# EAGLE design rs232 (EAGLE 9.2.2)
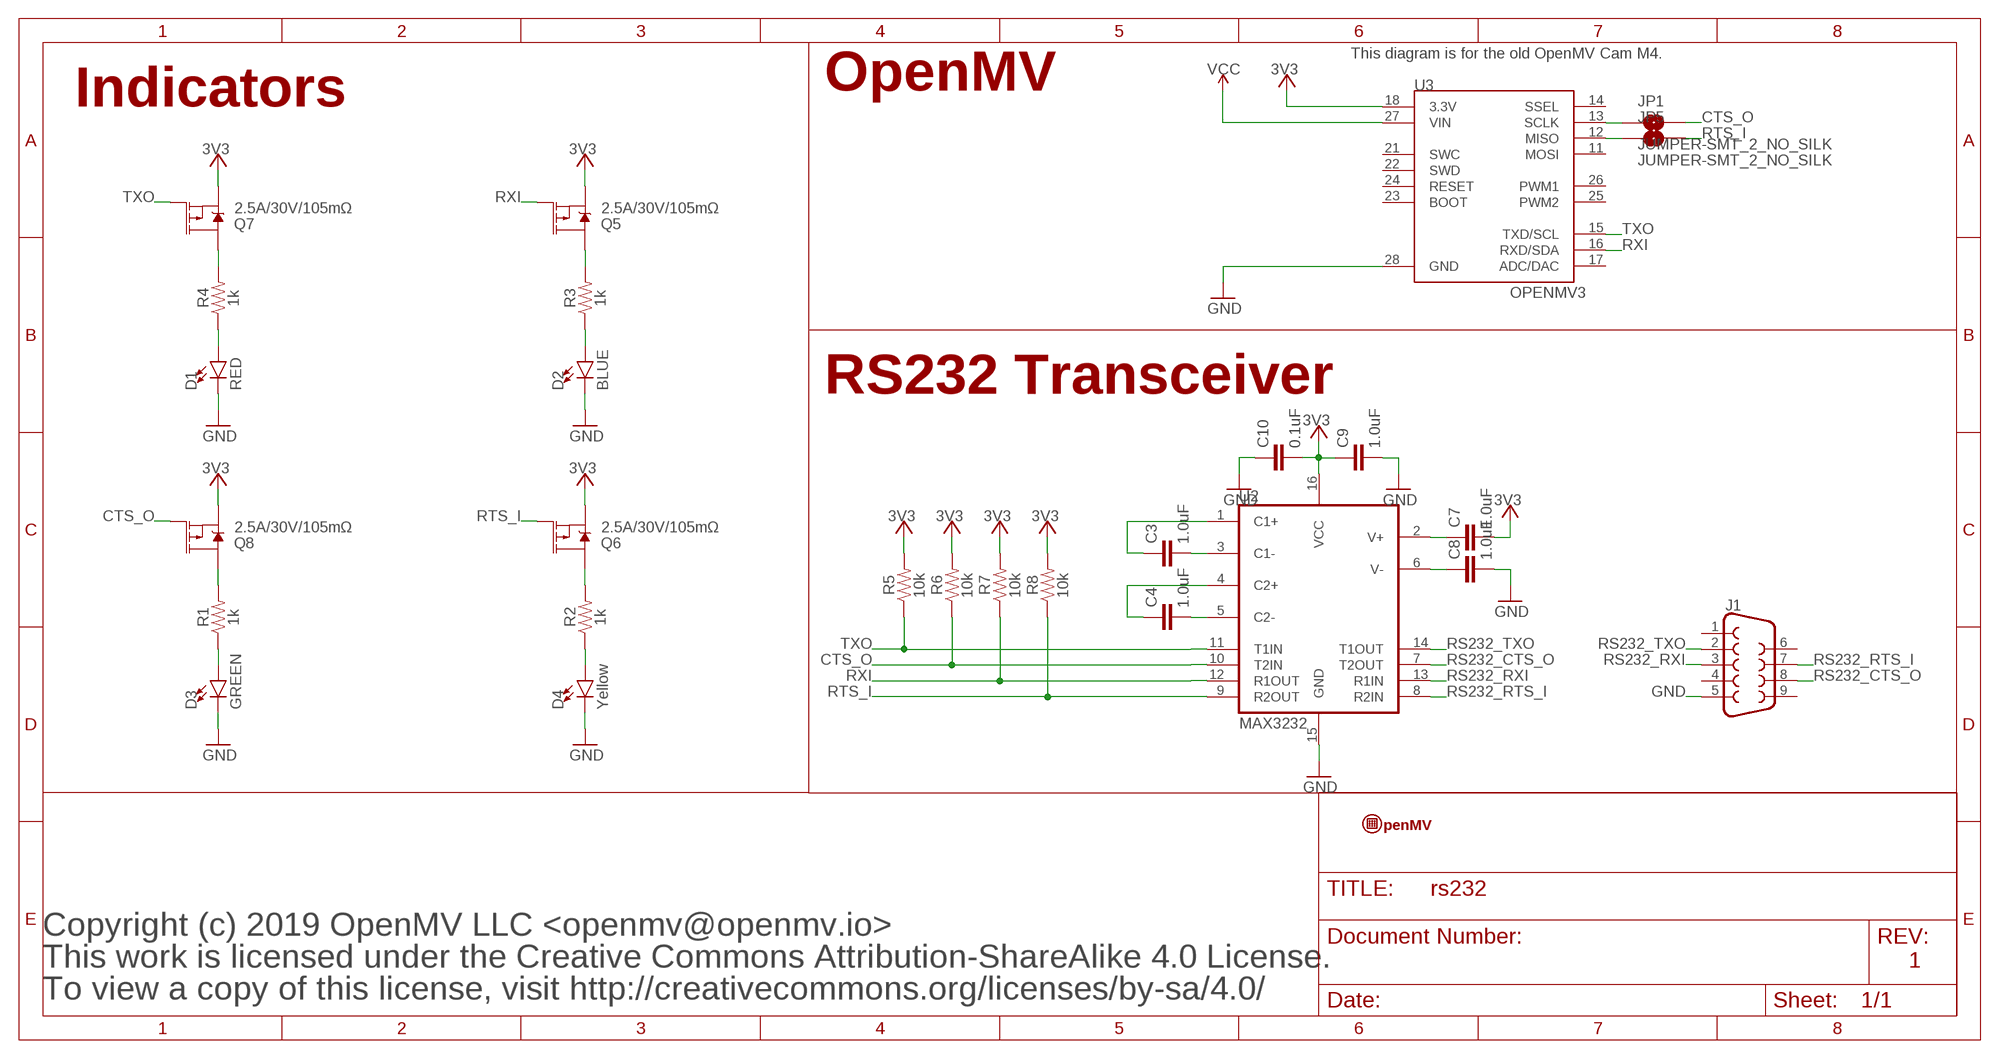
[diagram p0: schematic, sheet 1]

## Parts
C3  1.0uF  1.0UF-0603-16V-10%  [0603]
C4  1.0uF  1.0UF-0603-16V-10%  [0603]
C7  1.0uF  1.0UF-0603-16V-10%  [0603]
C8  1.0uF  1.0UF-0603-16V-10%  [0603]
C9  1.0uF  1.0UF-0603-16V-10%  [0603]
C10  0.1uF  0.1UF-0603-25V-(+80/-20%)  [0603]
D1  RED  LED-RED0603  [LED-0603]
D2  BLUE  LED-BLUE0603  [LED-0603]
D3  GREEN  LED-GREEN0603  [LED-0603]
D4  Yellow  LED-YELLOW0603  [LED-0603]
J1  DB9FEMALE  [DB9]
JP1  JUMPER-SMT_2_NO_SILK  [SMT-JUMPER_2_NO_SILK]
JP5  JUMPER-SMT_2_NO_SILK  [SMT-JUMPER_2_NO_SILK]
Q5  2.5A/30V/105mΩ  MOSFET_PCH-DMG2307L  [SOT23-3]
Q6  2.5A/30V/105mΩ  MOSFET_PCH-DMG2307L  [SOT23-3]
Q7  2.5A/30V/105mΩ  MOSFET_PCH-DMG2307L  [SOT23-3]
Q8  2.5A/30V/105mΩ  MOSFET_PCH-DMG2307L  [SOT23-3]
R1  1k  1KOHM-0603-1/10W-1%  [0603]
R2  1k  1KOHM-0603-1/10W-1%  [0603]
R3  1k  1KOHM-0603-1/10W-1%  [0603]
R4  1k  1KOHM-0603-1/10W-1%  [0603]
R5  10k  10KOHM-0603-1/10W-1%  [0603]
R6  10k  10KOHM-0603-1/10W-1%  [0603]
R7  10k  10KOHM-0603-1/10W-1%  [0603]
R8  10k  10KOHM-0603-1/10W-1%  [0603]
U2  MAX3232  MAX2323SOIC16  [SO16]
U3  OPENMV3  [OPENMV3]
U$9  OPENMV-LOGO  [OPENMV-LOGO]

## Nets
3V3: C7.2 C9.1 C10.2 Q5.2(S) Q6.2(S) Q7.2(S) Q8.2(S) R5.2 R6.2 R7.2 R8.2 U2.16(VCC) U3.18(3.3V)
CTS_O: JP1.2 Q8.1(G) R6.1 U2.10(T2IN)
GND: C8.2 C9.2 C10.1 D1.C D2.C D3.C D4.C J1.5 U2.15(GND) U3.28(GND)
INT_CTS_O: JP1.1 U3.13(SCLK)
INT_RTS_I: JP5.1 U3.12(MISO)
N$1: C4.2 U2.5(C2-)
N$2: C4.1 U2.4(C2+)
N$3: C3.2 U2.3(C1-)
N$4: C3.1 U2.1(C1+)
N$5: C8.1 U2.6(V-)
N$6: Q7.3(D) R4.2
N$7: Q5.3(D) R3.2
N$8: Q6.3(D) R2.2
N$9: C7.1 U2.2(V+)
N$10: Q8.3(D) R1.2
N$11: D4.A R2.1
N$12: D3.A R1.1
N$13: D2.A R3.1
N$14: D1.A R4.1
RS232_CTS_O: J1.8 U2.7(T2OUT)
RS232_RTS_I: J1.7 U2.8(R2IN)
RS232_RXI: J1.3 U2.13(R1IN)
RS232_TXO: J1.2 U2.14(T1OUT)
RTS_I: JP5.2 Q6.1(G) R8.1 U2.9(R2OUT)
RXI: Q5.1(G) R7.1 U2.12(R1OUT) U3.16(RXD/SDA)
TXO: Q7.1(G) R5.1 U2.11(T1IN) U3.15(TXD/SCL)
VCC: U3.27(VIN)
Unconnected: J1.1 J1.4 J1.6 J1.9 U3.11(MOSI) U3.14(SSEL) U3.17(ADC/DAC) U3.21(SWC) U3.22(SWD) U3.23(BOOT) U3.24(RESET) U3.25(PWM2) U3.26(PWM1)

## Notes on the sheet
- This diagram is for the old OpenMV Cam M4.
- Indicators | OpenMV
- RS232 Transceiver
- Copyright (c) 2019 OpenMV LLC <openmv@openmv.io>
- This work is licensed under the Creative Commons Attribution-ShareAlike 4.0 License. | 1
- To view a copy of this license, visit http://creativecommons.org/licenses/by-sa/4.0/

## Library data of the parts
C3 C4 C7-C9 = SparkFun-Capacitors:1.0UF: 1µF ceramic capacitors A capacitor is a passive two-terminal electrical component used to store electrical energy temporarily in an electric field.; PROD_ID: CAP-00868
C10 = SparkFun-Capacitors:0.1UF: 0.1µF ceramic capacitors A capacitor is a passive two-terminal electrical component used to store electrical energy temporarily in an electric field.; PROD_ID: CAP-00810
D1 = SparkFun-LED:LED-RED: Red SMD LED Used in manufacturing of most products at SparkFun Packages: 0603 - SMD 0603 package [Product Link] <http://docs.avagotech.com/docs/AV02-0551EN> 0603 SMART - SMD 0603 SMART package ( more efficient and expensive)[Product Link] <http://www.osram-os.com/Graphics/XPic2/00077099_0.pdf> 1206 - SMD1206 package [Product Link] <https://www.sparkfun.com/datasheets/DevTools/LilyPad/Q150OVS4.pdff> SparkFun Products: Pro Mini 328 -5V <https://www.sparkfun.com/products/821> RedBoard <https://www.sparkfun.com/products/12757> IOIO-OTG <https://www.sparkfun.com/products/13613>; PROD_ID: DIO-00819
D2 = SparkFun-LED:LED-BLUE: Blue SMD LED Used in manufacturing of various products at SparkFun Packages: 0603 - SMD 0603 package [Product Link] <http://www.digikey.com/product-detail/en/SMLE12BC7TT86/511-1589-2-ND/1641808> 1206 - SMD1206 package [Product Link] <http://www.digikey.com/product-detail/en/lite-on-inc/LTST-C150TBKT/160-1643-1-ND/573584> SparkFun Products: ESP8266 Thing-Dev Board <https://www.sparkfun.com/products/13711> RedBoard <https://www.sparkfun.com/products/12757>; PROD_ID: DIO-08575
D3 = SparkFun-LED:LED-GREEN: Green SMD LED Used in manufacturing of various products at SparkFun Packages: 0603 - SMD 0603 package [Product Link] <http://www.futureelectronics.com/en/technologies/semiconductors/optoelectronics/leds/Pages/9894312-LTST-C190GKT.aspx?CrossPart=HSMG-C190&IM=0> LilyPad 1206 - SMD1206 LilyPad package [Product Link] <http://www.futureelectronics.com/en/Technologies/Product.aspx?ProductID=IN150NGHARVATEKCORPORATION2049943&IM=0> 1206 - SMD1206 package [Product Link] <http://www.futureelectronics.com/en/technologies/semiconductors/optoelectronics/leds/Pages/8315665-LTST-C150KGKT.aspx?IM=0> 1206 Bottom Mount -SMD 1206 Bottom Mount [Product Link] <http://www.digikey.com/product-detail/en/lite-on-inc/LTST-C230KGKT/160-1456-1-ND/386854> SparkFun Products: Pro Mini 328 -5V <https://www.sparkfun.com/products/821> RedBoard <https://www.sparkfun.com/products/12757> MP3 Trigger <https://www.sparkfun.com/products/13720> Makey Makey <https://www.sparkfun.com/products/11076>; PROD_ID: DIO-00821
D4 = SparkFun-LED:LED-YELLOW: Yellow SMD LED Used in manufacturing several products at SparkFun. Packages: 0603 - SMD 0603 package[Product Link] <http://www.kingbrightusa.com/product.asp?catalog_name=LED&product_id=APT1608SYCK> 0603 -SMART - SMART SMD 0603 package (more efficient/more expensive) [Product Link] <http://www.osram-os.com/osram_os/en/products/product-catalog/led-light-emitting-diodes/smartled-0603/ly-l29k/index.jsp> LilyPad - SMD1206 package[Product Datasheet] <https://www.sparkfun.com/datasheets/DevTools/LilyPad/Q150YUS4.pdf> SparkFun Products: Blynk Board <https://www.sparkfun.com/products/13794> IOIO-OTG <https://www.sparkfun.com/products/13613> XBee Explorer Serial <https://www.sparkfun.com/products/13225>; PROD_ID: DIO-09003
J1 = SparkFun-Connectors:DB9: DB9 Connector Standard DB9 (D-Sub 9) serial connector. Can be used for CAN bus as well as RS485 and RS232. Footprint production proven. Here is the female version connector we sell at SparkFun: 9 Pin Female Serial Connector - PCB Mount <https://www.sparkfun.com/products/429> (PRT-00429) This connector has been used on the following SparkFun products: SparkFun RS232 Shifter - SMD <https://www.sparkfun.com/products/449> (PRT-00449) SparkFun RS232 Shifter SMD (No DB9) <https://www.sparkfun.com/products/8780> (PRT-08780); PROD_ID: CONN-08194
JP1 JP5 = SparkFun-Jumpers:JUMPER-SMT_2_NO: Normally open jumper This jumper has two pads in close proximity to each other. Apply solder to close the connection. Round pads are easier to solder for beginners, but are a lot larger. SparkFun Product that uses the round pads: SparkFun EL Sequencer <https://www.sparkfun.com/products/12781>
Q5-Q8 = SparkFun-DiscreteSemi:MOSFET_PCH: P-channel MOSFETs Voltage controlled devices that allow control of high current outputs. SparkFun Products: SparkFun ESP32 Thing <https://www.sparkfun.com/products/13907> SparkFun ESP8266 Thing <https://www.sparkfun.com/products/13231>; PROD_ID: TRANS-11308
R1-R4 = SparkFun-Resistors:1KOHM: 1kΩ resistor A resistor is a passive two-terminal electrical component that implements electrical resistance as a circuit element. Resistors act to reduce current flow, and, at the same time, act to lower voltage levels within circuits. - Wikipedia; PROD_ID: RES-07856
R5-R8 = SparkFun-Resistors:10KOHM: 10kΩ resistor A resistor is a passive two-terminal electrical component that implements electrical resistance as a circuit element. Resistors act to reduce current flow, and, at the same time, act to lower voltage levels within circuits. - Wikipedia; PROD_ID: RES-00824
U2 = SparkFun-IC-Comms:MAX2323: RS232 Transceiver This part covers 232 drivers that are compatible with the MAX3232. Sipex SP3232EB Datasheet <http://cdn.sparkfun.com/datasheets/Components/General%20IC/SP3232EBCA-L.pdf> SparkFun Products SOIC component <https://www.sparkfun.com/products/589> (COM-00589 / IC-08171) Retired DIP component (COM-00316 / IC-08446) SparkFun Transceiver Breakout - MAX3232 <https://www.sparkfun.com/products/11189> (BOB-11189) SparkFun XBee Explorer Serial <https://www.sparkfun.com/products/13225> (WRL-13225); PROD_ID: IC-08171
U3 = openmv:OPENMV3
U$9 = openmv:OPENMV-LOGO

## Net classes
1 vcc: width 1.016 mm, clearance 0.203 mm
2 antenna: width 0.363 mm, clearance 0.305 mm
3 1.8v: width 0.457 mm, clearance 0.254 mm

## Board
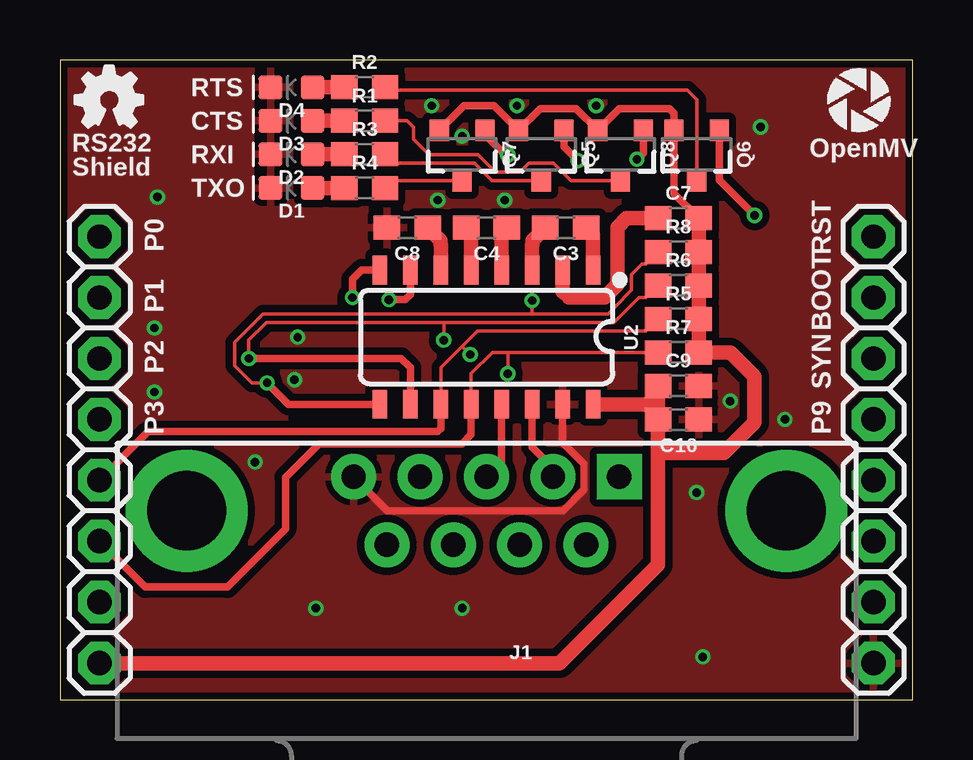
[diagram p1: board, top side]
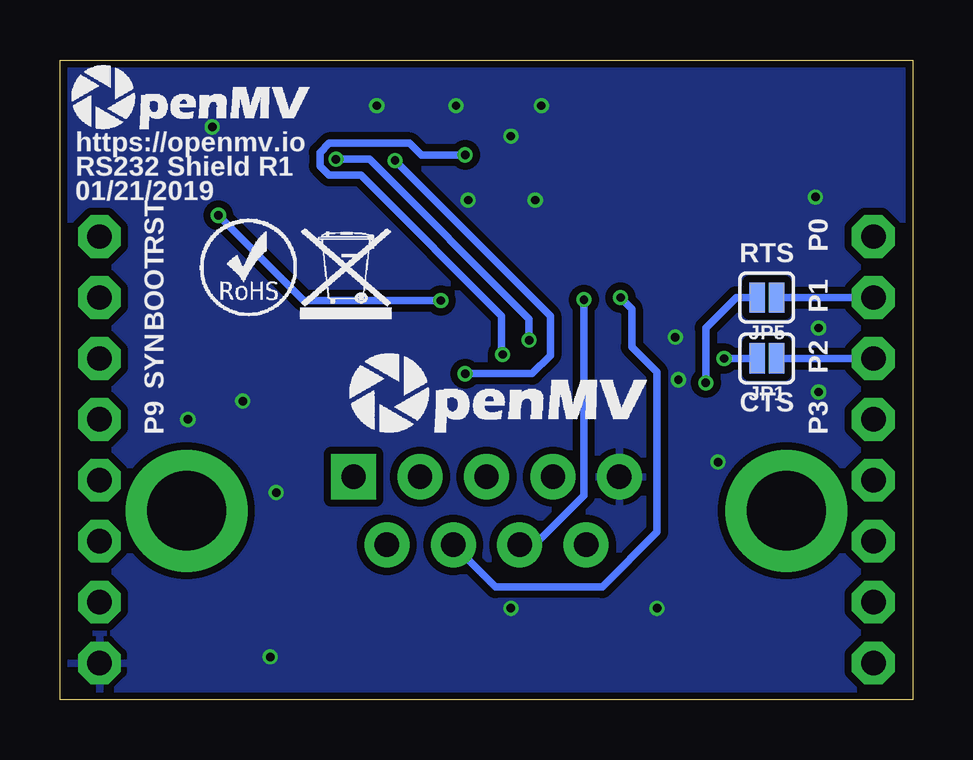
[diagram p2: board, bottom side, seen from below]

Size 35.56 x 26.67 mm. Coordinates in mm from the lower left corner, seen from the top.
Outline: 0,0 35.56,0 35.56,26.67 0,26.67 0,0
Copper layers (1*16): Top 0.035mm / dielectric 1.5mm / Bottom 0.035mm
Design rules "openmv3 *": minimum track width 5mil, minimum drill 10mil, track to track 8mil, track to pad 8mil, pad to pad 8mil, via to via 8mil, smd to smd 8mil, copper to edge 5mil, drill to drill 10mil, minimum pad ring 10mil, minimum via ring 4mil, stop-mask expansion 2mil, vias tented up to drill 30mil, thermal gap 10mil

### Footprints (pad centres in the part's own frame; a part is rotated, then mirrored left to right if it is on the bottom)
0603 = smd 1.1 x 1: 1 -0.85,0; 2 0.85,0
LED-0603 = smd 1 x 1: A -0.877,0; C 0.877,0
DB9 = drill 1.016 pad 1.88 square: 1 -5.54,-1.42 | drill 1.016 pad 1.88: 2 -2.77,-1.42; 3 0,-1.42; 4 2.77,-1.42; 5 5.54,-1.42; 6 -4.15,1.42; 7 -1.38,1.42; 8 1.38,1.42; 9 4.15,1.42 | drill 3.302 pad 5.08: G1 -12.5,0; G2 12.5,0
SMT-JUMPER_2_NO_SILK = smd 0.635 x 1.27: 1 -0.406,0; 2 0.406,0
SOT23-3 = smd 0.8 x 0.9: 1 -0.95,-1; 2 0.95,-1; 3 0,1.1
SO16 = smd 0.6 x 1.2: 1 -4.445,-2.8; 2 -3.175,-2.8; 3 -1.905,-2.8; 4 -0.635,-2.8; 5 0.635,-2.8; 6 1.905,-2.8; 7 3.175,-2.8; 8 4.445,-2.8; 9 4.445,2.8; 10 3.175,2.8; 11 1.905,2.8; 12 0.635,2.8; 13 -0.635,2.8; 14 -1.905,2.8; 15 -3.175,2.8; 16 -4.445,2.8
OPENMV3 = drill 1.016 pad 1.778 octagon: 11 1.651,19.304; 12 1.651,16.764; 13 1.651,14.224; 14 1.651,11.684; 15 1.651,9.144; 16 1.651,6.604; 17 1.651,4.064; 18 1.651,1.524; 21 33.909,19.304; 22 33.909,16.764; 23 33.909,14.224; 24 33.909,11.684; 25 33.909,9.144; 26 33.909,6.604; 27 33.909,4.064; 28 33.909,1.524

### Placement (x,y rotation side)
C3  21.08,19.68 180 top
C4  17.78,19.68 180 top
C7  25.78,20.07 0 top
C8  14.48,19.68 180 top
C9  25.78,13.08 0 top
C10  25.78,11.68 180 top
D1  9.65,21.34 180 top
D2  9.65,22.73 180 top
D3  9.65,24.13 180 top
D4  9.65,25.53 180 top
J1  17.78,7.87 180 top
JP1  6.1,14.22 180 bottom
JP5  6.1,16.76 180 bottom
Q5  20.07,22.73 180 top
Q6  26.54,22.73 180 top
Q7  16.76,22.73 180 top
Q8  23.37,22.73 180 top
R1  12.7,24.13 0 top
R2  12.7,25.53 0 top
R3  12.7,22.73 0 top
R4  12.7,21.34 0 top
R5  25.78,15.88 0 top
R6  25.78,17.27 0 top
R7  25.78,14.48 0 top
R8  25.78,18.67 0 top
U2  17.78,15.11 180 top
U3  0,0 0 top
U$3  [OMV-LOGO]  23.62,10.92 0 bottom
U$5  [ROHS]  29.72,16 0 bottom
U$6  [WEEE]  25.53,15.88 0 bottom
U$9  31.88,23.5 0 top
U$10  [OMV-LOGO-SMALL]  35.18,23.62 0 bottom
U$11  [OSHW_FILLX100_NOTEXT]  0.64,23.88 0 top

### Tracks (layer width: path | path; a pad name or v marks a point on that pad's centre or on a via)
3V3
  Top 0.305: C7.2 25.59,21.1 25.59,23.62 Q6.2 25.59,24.45 25.4,24.64 23.32,24.64 Q8.2 21.51,24.64 20.02,24.64 Q5.2 18.08,24.77 16.85,24.77 Q7.2
  Top 0.61: U3.18 20.83,1.52 24.93,5.63 24.93,10.29 | 24.93,10.29 C10.2 24.93,12.32 | 24.93,10.29 27.69,10.29 28.96,11.56 28.96,13.46 27.94,14.48 R7.2 R5.2 R6.2 R8.2 C7.2 | C9.1 24.93,12.32 | U2.16 24.93,12.31 24.93,12.32
CTS_O  (via drill 0.35)
  Top 0.152: R6.1 24.42,16.76 24.13,16.76 23.09,15.72 16,15.72 | v7.87,14.22 7.87,14.99 8.61,15.72 16,15.72 | v16,14.99 16,15.72
  Top 0.305: U2.10 14.61,13.84 14.22,14.22 10.16,14.22 | 10.16,14.22 10.03,14.22 | 10.03,14.22 v7.87,14.22 | 10.16,14.22 10.03,14.22 | Q8.1 24.32,22.79 v24.05,22.53
  Bottom 0.305: v7.87,14.22 JP1.2 | v16,14.99 16,15.88 22.66,22.53 v24.05,22.53
GND  (via drill 0.35)
  Top 0.305: J1.5 13.66,7.87 20.96,7.87 21.84,8.76 21.84,9.83 20.95,10.72 U2.15
  other vias: 27.94,12.45 26.54,8.64 30.23,11.68 4.06,20.95 3.94,15.49 3.94,12.83 8.13,9.91 10.67,3.81 16.76,3.81 26.8,1.78 29.21,23.88 9.78,13.34 15.75,20.83 16.76,23.5 9.91,15.11 15.49,24.77 19.05,24.77 22.35,24.77 18.54,20.83
  pour Bottom (isolate 0.305): 0,0 35.56,0 35.56,26.67 0,26.67
  pour Top (isolate 0.305): 0,0 35.56,0 35.56,26.67 0,26.67
INT_CTS_O
  Bottom 0.305: JP1.1 U3.13
INT_RTS_I
  Bottom 0.305: JP5.1 U3.12
N$1
  Top 0.61: C4.2 17.14,19.47 U2.5
N$2
  Top 0.61: C4.1 18.41,19.47 U2.4
N$3
  Top 0.61: U2.3 19.68,18.97 19.69,18.98 19.69,19.14 C3.2
N$4
  Top 0.61: U2.1 22.23,19.39 C3.1
N$5
  Top 0.61: C8.1 15.87,19.14 15.87,18.98 15.88,18.97 U2.6
N$6
  Top 0.152: Q7.3 13.85,21.63
  Top 0.305: 13.85,21.63 R4.2
N$7
  Top 0.152: Q5.3 18.01,21.63 17.28,22.36 13.92,22.36 R3.2
  Top 0.305: 13.84,22.44 R3.2
N$8
  Top 0.152: R2.2 13.68,25.4 26.16,25.4 26.54,25.02 Q6.3
N$9
  Top 0.61: U2.2 20.95,17.02 21.21,16.76 22.69,16.76 23.24,17.31 23.24,19.68 23.62,20.07 C7.1
N$10
  Top 0.152: Q8.3 21.31,21.63 20.58,22.36 19.55,22.36 19.18,21.99 18.16,21.99 17.43,22.72 15.38,22.72 14.73,23.37 14.73,23.88 14.48,24.13 R1.2
N$11
  Top 0.61: D4.A R2.1
N$12
  Top 0.61: D3.A R1.1
N$13
  Top 0.61: D2.A R3.1
N$14
  Top 0.61: D1.A R4.1
RS232_CTS_O  (via drill 0.35)
  Top 0.305: v13.72,16.67 14.39,16.67 14.61,16.89 U2.7
  Bottom 0.305: v13.72,16.67 13.72,9.83 13.71,9.83 13.71,8.51 15.77,6.45 J1.8
RS232_RTS_I  (via drill 0.35)
  Top 0.305: U2.8 12.58,17.91 12.19,17.53 v12.19,16.76
  Bottom 0.305: v12.19,16.76 11.72,16.29 11.72,14.71 10.67,13.66 10.67,6.99 12.95,4.7 17.41,4.7 J1.7
RS232_RXI
  Top 0.305: U2.13 18.41,9.93 J1.3
RS232_TXO
  Top 0.305: U2.14 19.68,10.54 20.55,9.68 J1.2
RTS_I  (via drill 0.35)
  Top 0.152: R8.1 24.42,18.16 24.26,18.16 23.82,17.73 23.82,17.07 23.13,16.37 | 23.13,16.37 22.84,16.08 | 22.84,16.08 23.13,16.37 | v8.64,13.21 8,13.21 7.28,13.93 7.28,14.89 8.46,16.08 19.68,16.08 | 19.68,16.08 22.84,16.08 | v19.68,16.64 19.68,16.08
  Top 0.305: v8.64,13.21 9.53,12.31 U2.9 | Q6.1 27.49,21.66 v28.96,20.19
  Bottom 0.305: JP5.2 7.37,16.76 8.64,15.49 v8.64,13.21 | v28.96,20.19 25.4,16.64 v19.68,16.64
RXI  (via drill 0.35)
  Top 0.152: R7.1 18.67,14.48 | 18.67,14.48 18.03,14.48 17.14,13.59 U2.12 | v18.67,13.59 18.67,14.48
  Top 0.305: U2.12 17.14,11.05 16.76,10.67 10.79,10.67 9.4,9.27 9.4,7.11 6.99,4.7 3.56,4.7 U3.16 | Q5.1 21.02,23.05 v21.59,22.48
  Bottom 0.305: v21.59,22.48 15.11,16 15.11,14.35 15.88,13.59 v18.67,13.59
TXO  (via drill 0.35)
  Top 0.152: R5.1 24.42,15.37 17.4,15.37 16.76,14.73 | 16.76,14.73 15.88,13.84 U2.11 | v17.11,14.39 16.76,14.73
  Top 0.305: U3.15 3.68,11.18 15.75,11.18 15.88,11.3 U2.11 | Q7.1 17.71,23.56 18.57,22.71 v18.67,22.71
  Bottom 0.305: v18.67,22.71 20.49,22.71 20.98,23.2 24.33,23.2 24.73,22.81 24.73,22.25 24.33,21.86 23,21.86 22.73,21.59 17.14,16 17.14,14.35 v17.11,14.39

### Text on the board
tPlace: RTS | CTS | OpenMV | RS232 / Shield | RXI | TXO | P0 | RST | P1 | BOOT | P2 | SYN | P3 | P9
bPlace: https://openmv.io | RS232 Shield R1 | 01/21/2019 | P0 | RTS | RST | P1 | BOOT | P2 | CTS | SYN | P3 | P9